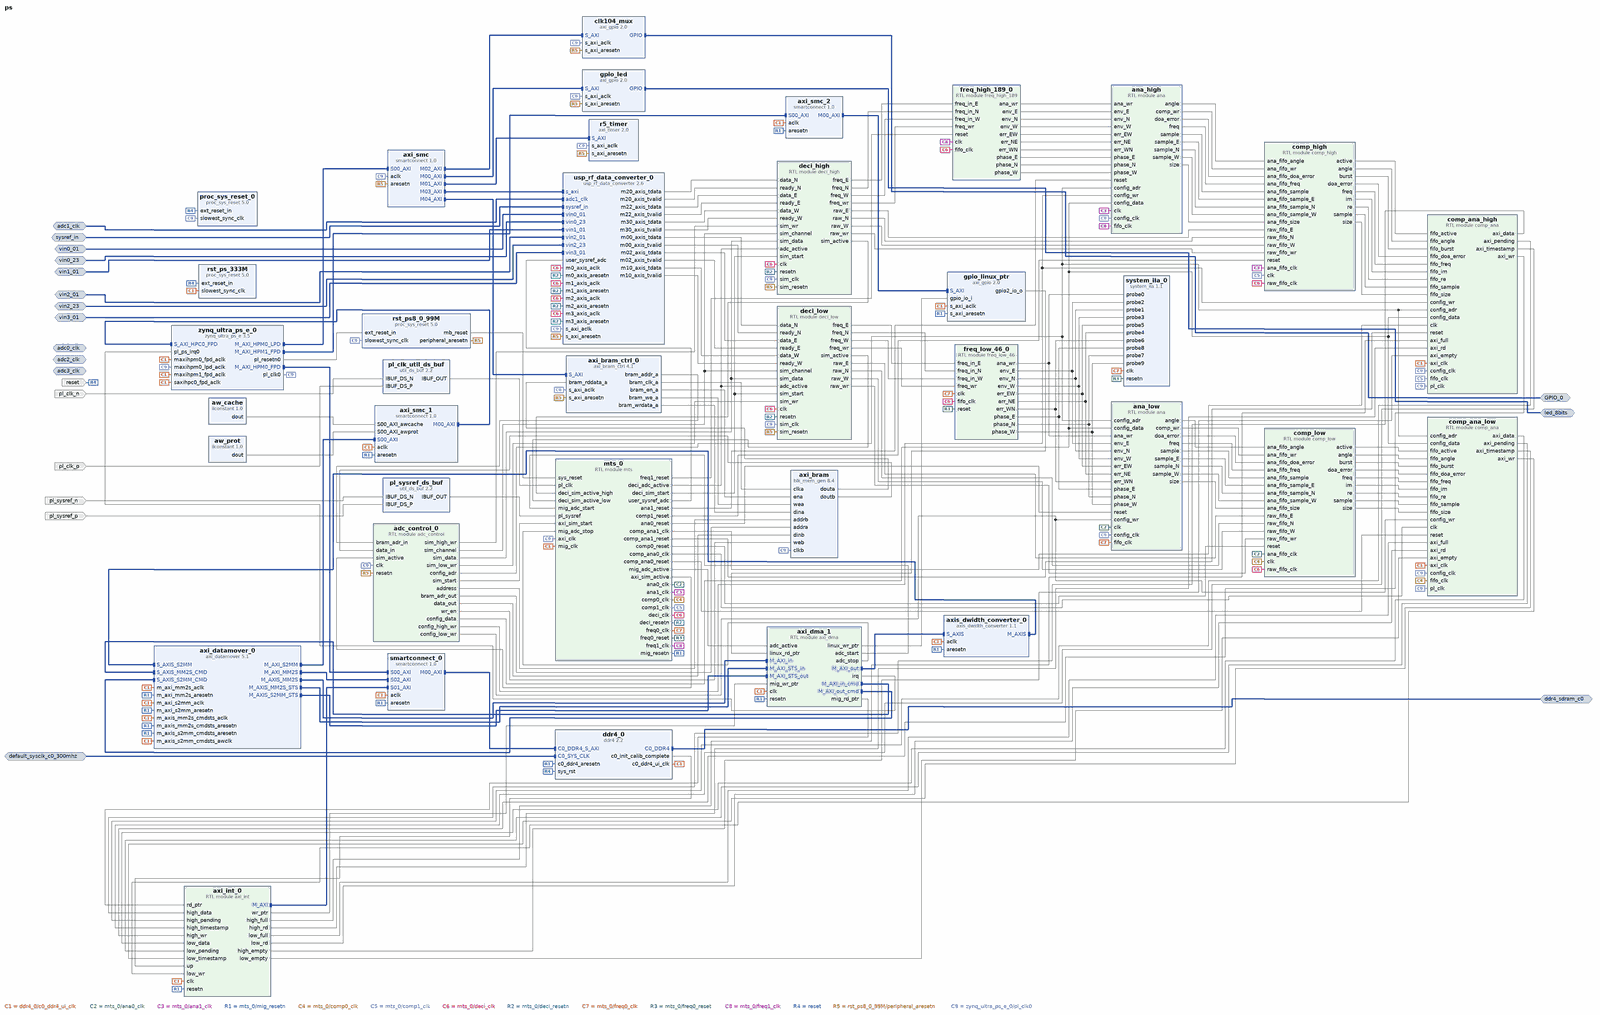
[diagram p0: block diagram of the top level, whole]
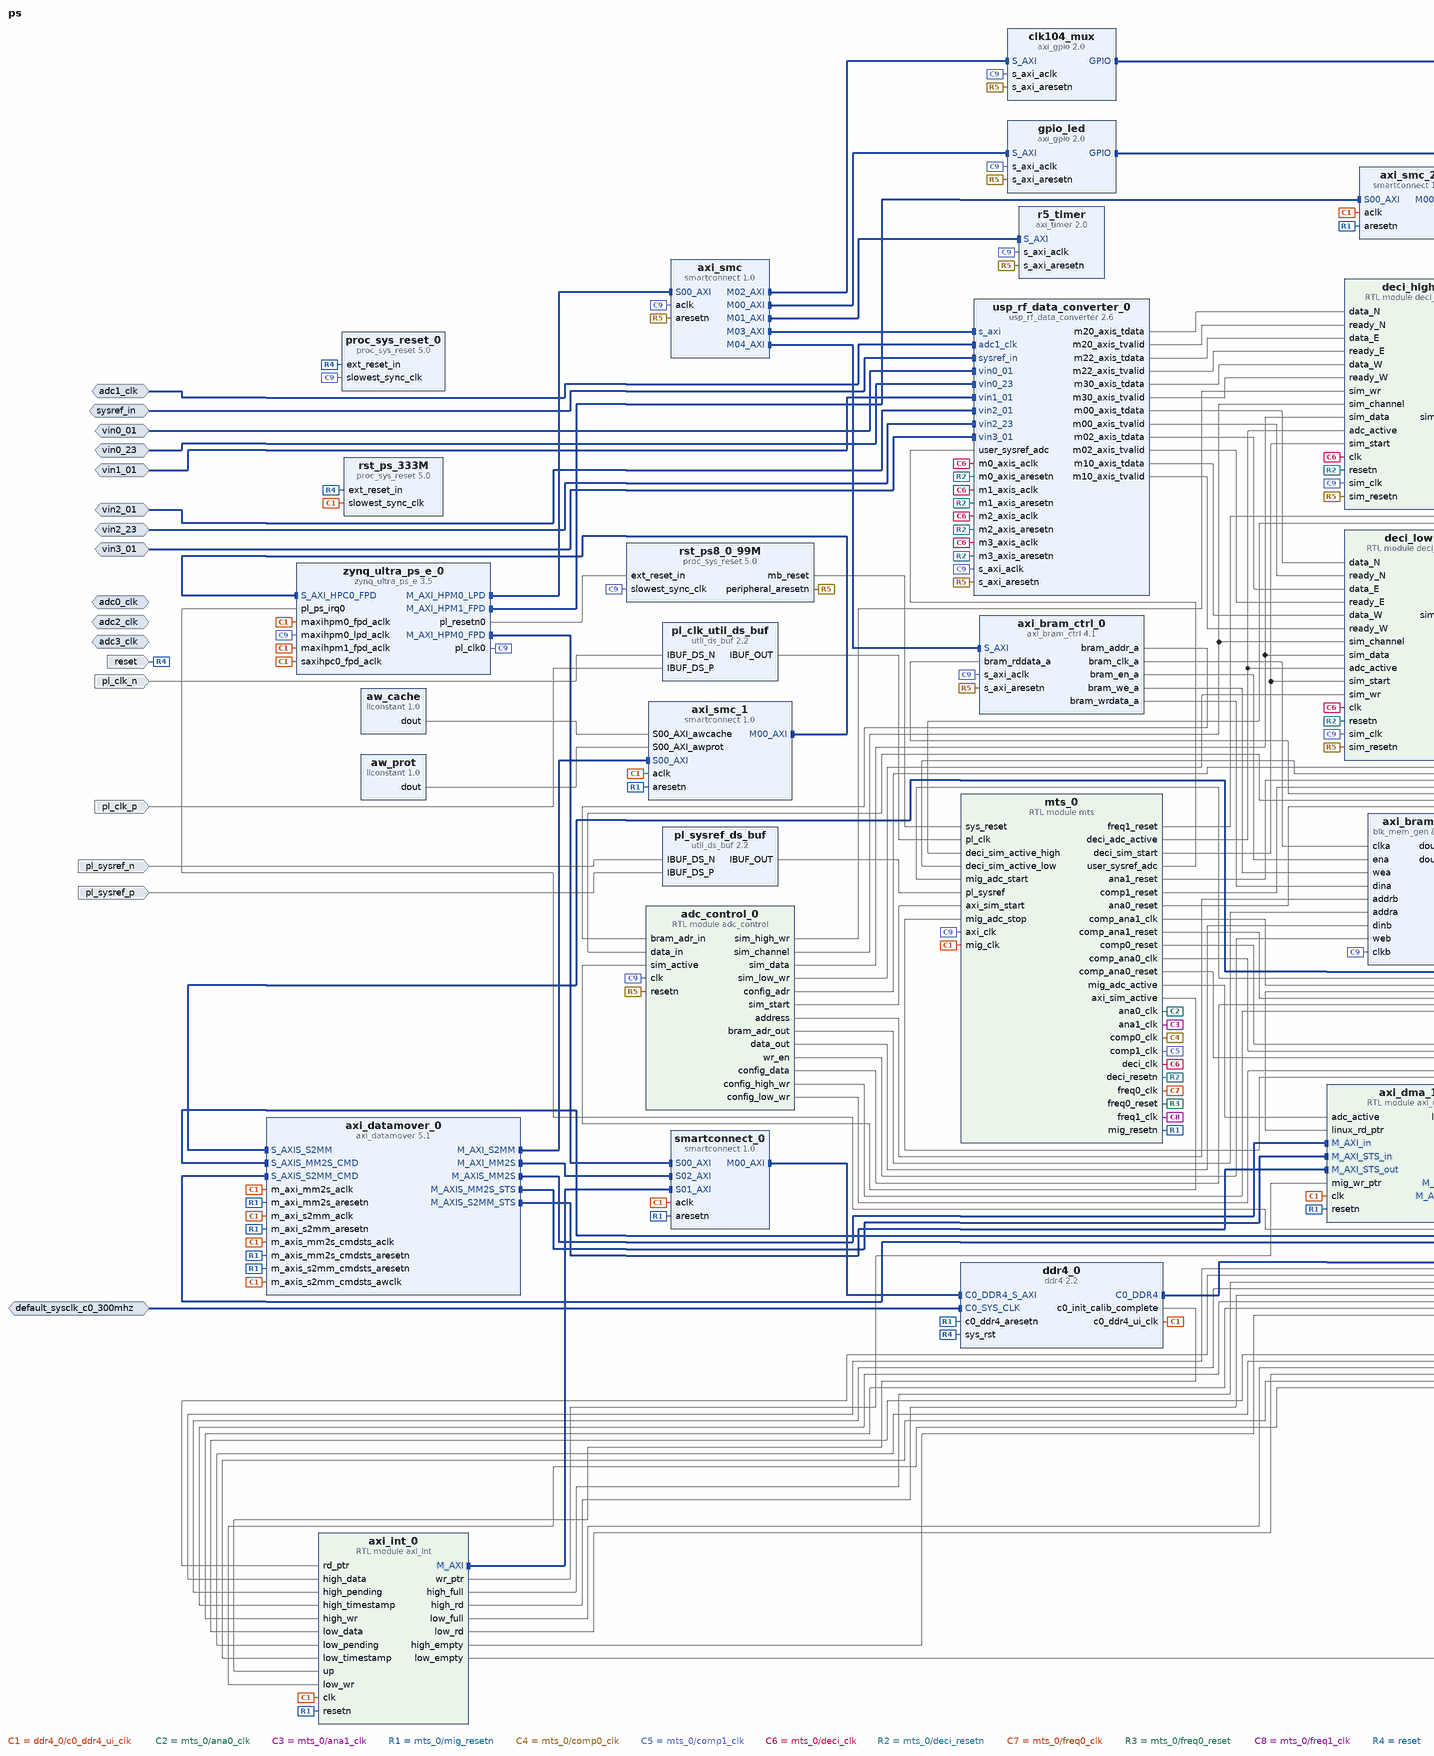
[diagram p1: block diagram of the top level, left part]
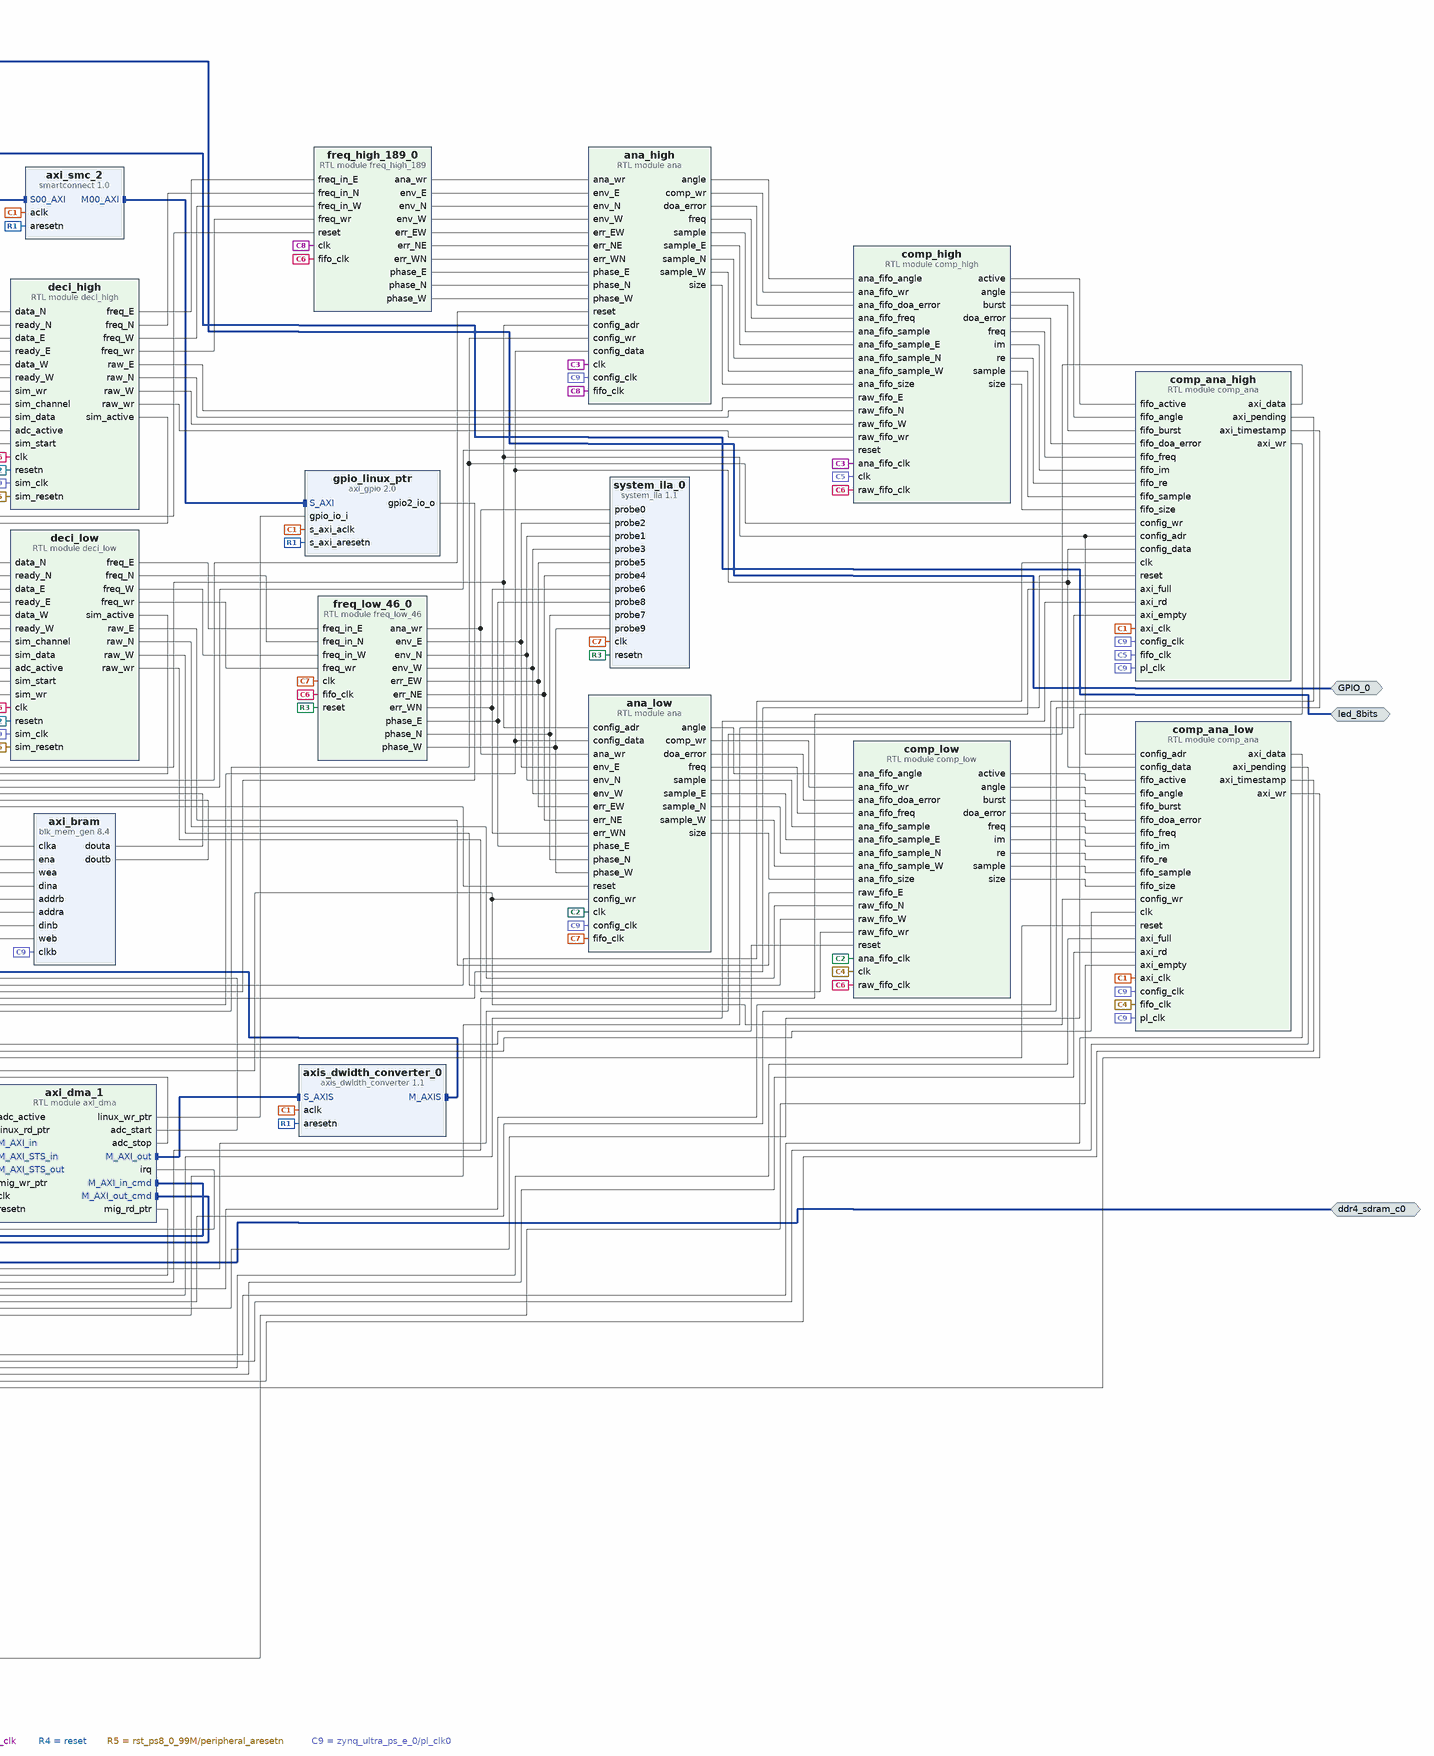
[diagram p2: block diagram of the top level, right part]
# Vivado block design ps, xczu48dr-fsvg1517-2-e, Vivado 2025.1
create_bd_design ps

create_bd_intf_port -mode Master -vlnv xilinx.com:interface:gpio_rtl:1.0 led_8bits
create_bd_intf_port -mode Master -vlnv xilinx.com:interface:gpio_rtl:1.0 GPIO_0
create_bd_intf_port -mode Slave -vlnv xilinx.com:interface:diff_analog_io_rtl:1.0 vin0_01
create_bd_intf_port -mode Slave -vlnv xilinx.com:interface:diff_analog_io_rtl:1.0 vin0_23
create_bd_intf_port -mode Slave -vlnv xilinx.com:interface:diff_analog_io_rtl:1.0 vin1_01
create_bd_intf_port -mode Slave -vlnv xilinx.com:interface:diff_analog_io_rtl:1.0 vin2_01
create_bd_intf_port -mode Slave -vlnv xilinx.com:interface:diff_analog_io_rtl:1.0 vin2_23
create_bd_intf_port -mode Slave -vlnv xilinx.com:interface:diff_analog_io_rtl:1.0 vin3_01
create_bd_intf_port -mode Slave -vlnv xilinx.com:display_usp_rf_data_converter:diff_pins_rtl:1.0 sysref_in
create_bd_intf_port -mode Slave -vlnv xilinx.com:interface:diff_clock_rtl:1.0 adc1_clk
set_property -dict {CONFIG.FREQ_HZ 500000000.0} [get_bd_intf_ports adc1_clk]
create_bd_intf_port -mode Slave -vlnv xilinx.com:interface:diff_clock_rtl:1.0 adc0_clk
set_property -dict {CONFIG.FREQ_HZ 4000000000.0} [get_bd_intf_ports adc0_clk]
create_bd_intf_port -mode Slave -vlnv xilinx.com:interface:diff_clock_rtl:1.0 adc2_clk
set_property -dict {CONFIG.FREQ_HZ 4000000000.0} [get_bd_intf_ports adc2_clk]
create_bd_intf_port -mode Slave -vlnv xilinx.com:interface:diff_clock_rtl:1.0 adc3_clk
set_property -dict {CONFIG.FREQ_HZ 4000000000.0} [get_bd_intf_ports adc3_clk]
create_bd_intf_port -mode Master -vlnv xilinx.com:interface:ddr4_rtl:1.0 ddr4_sdram_c0
create_bd_intf_port -mode Slave -vlnv xilinx.com:interface:diff_clock_rtl:1.0 default_sysclk_c0_300mhz
set_property -dict {CONFIG.FREQ_HZ 300000000} [get_bd_intf_ports default_sysclk_c0_300mhz]
create_bd_port -dir I -type clk pl_clk_p
set_property -dict {CONFIG.FREQ_HZ 125000000} [get_bd_ports pl_clk_p]
create_bd_port -dir I -type clk pl_clk_n
set_property -dict {CONFIG.FREQ_HZ 125000000} [get_bd_ports pl_clk_n]
create_bd_port -dir I -type clk pl_sysref_p
set_property -dict {CONFIG.FREQ_HZ 10000000} [get_bd_ports pl_sysref_p]
create_bd_port -dir I -type clk pl_sysref_n
set_property -dict {CONFIG.FREQ_HZ 10000000} [get_bd_ports pl_sysref_n]
create_bd_port -dir I -type rst reset
set_property -dict {CONFIG.POLARITY ACTIVE_HIGH} [get_bd_ports reset]

create_bd_cell -type ip -vlnv xilinx.com:ip:zynq_ultra_ps_e:3.5 zynq_ultra_ps_e_0
set_property -dict [list \
  CONFIG.PSU_BANK_0_IO_STANDARD LVCMOS18 \
  CONFIG.PSU_BANK_1_IO_STANDARD LVCMOS18 \
  CONFIG.PSU_BANK_2_IO_STANDARD LVCMOS18 \
  CONFIG.PSU_DYNAMIC_DDR_CONFIG_EN 1 \
  CONFIG.PSU_USB3__DUAL_CLOCK_ENABLE 1 \
  CONFIG.PSU__CAN1__PERIPHERAL__ENABLE 0 \
  CONFIG.PSU__CRF_APB__ACPU_CTRL__FREQMHZ 1200 \
  CONFIG.PSU__CRF_APB__ACPU_CTRL__SRCSEL APLL \
  CONFIG.PSU__CRF_APB__APLL_CTRL__SRCSEL PSS_REF_CLK \
  CONFIG.PSU__CRF_APB__DBG_FPD_CTRL__FREQMHZ 250 \
  CONFIG.PSU__CRF_APB__DBG_FPD_CTRL__SRCSEL IOPLL \
  CONFIG.PSU__CRF_APB__DBG_TRACE_CTRL__FREQMHZ 250 \
  CONFIG.PSU__CRF_APB__DBG_TRACE_CTRL__SRCSEL IOPLL \
  CONFIG.PSU__CRF_APB__DBG_TSTMP_CTRL__FREQMHZ 250 \
  CONFIG.PSU__CRF_APB__DBG_TSTMP_CTRL__SRCSEL IOPLL \
  CONFIG.PSU__CRF_APB__DDR_CTRL__FREQMHZ 1066 \
  CONFIG.PSU__CRF_APB__DDR_CTRL__SRCSEL DPLL \
  CONFIG.PSU__CRF_APB__DPDMA_REF_CTRL__FREQMHZ 600 \
  CONFIG.PSU__CRF_APB__DPDMA_REF_CTRL__SRCSEL APLL \
  CONFIG.PSU__CRF_APB__DPLL_CTRL__SRCSEL PSS_REF_CLK \
  CONFIG.PSU__CRF_APB__DP_AUDIO_REF_CTRL__SRCSEL RPLL \
  CONFIG.PSU__CRF_APB__DP_STC_REF_CTRL__SRCSEL RPLL \
  CONFIG.PSU__CRF_APB__DP_VIDEO_REF_CTRL__SRCSEL VPLL \
  CONFIG.PSU__CRF_APB__GDMA_REF_CTRL__FREQMHZ 600 \
  CONFIG.PSU__CRF_APB__GDMA_REF_CTRL__SRCSEL APLL \
  CONFIG.PSU__CRF_APB__GPU_REF_CTRL__FREQMHZ 500 \
  CONFIG.PSU__CRF_APB__GPU_REF_CTRL__SRCSEL IOPLL \
  CONFIG.PSU__CRF_APB__TOPSW_LSBUS_CTRL__FREQMHZ 100 \
  CONFIG.PSU__CRF_APB__TOPSW_LSBUS_CTRL__SRCSEL IOPLL \
  CONFIG.PSU__CRF_APB__TOPSW_MAIN_CTRL__FREQMHZ 533.33 \
  CONFIG.PSU__CRF_APB__TOPSW_MAIN_CTRL__SRCSEL DPLL \
  CONFIG.PSU__CRF_APB__VPLL_CTRL__SRCSEL PSS_REF_CLK \
  CONFIG.PSU__CRL_APB__ADMA_REF_CTRL__FREQMHZ 500 \
  CONFIG.PSU__CRL_APB__ADMA_REF_CTRL__SRCSEL IOPLL \
  CONFIG.PSU__CRL_APB__CAN1_REF_CTRL__FREQMHZ 100 \
  CONFIG.PSU__CRL_APB__CAN1_REF_CTRL__SRCSEL IOPLL \
  CONFIG.PSU__CRL_APB__CPU_R5_CTRL__FREQMHZ 500 \
  CONFIG.PSU__CRL_APB__CPU_R5_CTRL__SRCSEL IOPLL \
  CONFIG.PSU__CRL_APB__DBG_LPD_CTRL__FREQMHZ 250 \
  CONFIG.PSU__CRL_APB__DBG_LPD_CTRL__SRCSEL IOPLL \
  CONFIG.PSU__CRL_APB__GEM3_REF_CTRL__FREQMHZ 125 \
  CONFIG.PSU__CRL_APB__GEM3_REF_CTRL__SRCSEL IOPLL \
  CONFIG.PSU__CRL_APB__I2C0_REF_CTRL__FREQMHZ 100 \
  CONFIG.PSU__CRL_APB__I2C0_REF_CTRL__SRCSEL IOPLL \
  CONFIG.PSU__CRL_APB__I2C1_REF_CTRL__FREQMHZ 100 \
  CONFIG.PSU__CRL_APB__I2C1_REF_CTRL__SRCSEL IOPLL \
  CONFIG.PSU__CRL_APB__IOPLL_CTRL__SRCSEL PSS_REF_CLK \
  CONFIG.PSU__CRL_APB__IOU_SWITCH_CTRL__FREQMHZ 250 \
  CONFIG.PSU__CRL_APB__IOU_SWITCH_CTRL__SRCSEL IOPLL \
  CONFIG.PSU__CRL_APB__LPD_LSBUS_CTRL__FREQMHZ 100 \
  CONFIG.PSU__CRL_APB__LPD_LSBUS_CTRL__SRCSEL IOPLL \
  CONFIG.PSU__CRL_APB__LPD_SWITCH_CTRL__FREQMHZ 500 \
  CONFIG.PSU__CRL_APB__LPD_SWITCH_CTRL__SRCSEL IOPLL \
  CONFIG.PSU__CRL_APB__PCAP_CTRL__FREQMHZ 200 \
  CONFIG.PSU__CRL_APB__PCAP_CTRL__SRCSEL IOPLL \
  CONFIG.PSU__CRL_APB__PL0_REF_CTRL__FREQMHZ 100 \
  CONFIG.PSU__CRL_APB__PL0_REF_CTRL__SRCSEL IOPLL \
  CONFIG.PSU__CRL_APB__QSPI_REF_CTRL__FREQMHZ 125 \
  CONFIG.PSU__CRL_APB__QSPI_REF_CTRL__SRCSEL IOPLL \
  CONFIG.PSU__CRL_APB__RPLL_CTRL__SRCSEL PSS_REF_CLK \
  CONFIG.PSU__CRL_APB__SDIO1_REF_CTRL__FREQMHZ 200 \
  CONFIG.PSU__CRL_APB__SDIO1_REF_CTRL__SRCSEL IOPLL \
  CONFIG.PSU__CRL_APB__TIMESTAMP_REF_CTRL__FREQMHZ 100 \
  CONFIG.PSU__CRL_APB__TIMESTAMP_REF_CTRL__SRCSEL IOPLL \
  CONFIG.PSU__CRL_APB__UART0_REF_CTRL__FREQMHZ 100 \
  CONFIG.PSU__CRL_APB__UART0_REF_CTRL__SRCSEL IOPLL \
  CONFIG.PSU__CRL_APB__UART1_REF_CTRL__FREQMHZ 100 \
  CONFIG.PSU__CRL_APB__UART1_REF_CTRL__SRCSEL IOPLL \
  CONFIG.PSU__CRL_APB__USB0_BUS_REF_CTRL__FREQMHZ 250 \
  CONFIG.PSU__CRL_APB__USB0_BUS_REF_CTRL__SRCSEL IOPLL \
  CONFIG.PSU__CRL_APB__USB3_DUAL_REF_CTRL__FREQMHZ 20 \
  CONFIG.PSU__CRL_APB__USB3_DUAL_REF_CTRL__SRCSEL IOPLL \
  CONFIG.PSU__CRL_APB__USB3__ENABLE 1 \
  CONFIG.PSU__CSUPMU__PERIPHERAL__VALID 1 \
  CONFIG.PSU__DDRC__BUS_WIDTH {64 Bit} \
  CONFIG.PSU__DDRC__COMPONENTS UDIMM \
  CONFIG.PSU__DDRC__DEVICE_CAPACITY {8192 MBits} \
  CONFIG.PSU__DDRC__DRAM_WIDTH {16 Bits} \
  CONFIG.PSU__DDRC__ECC Disabled \
  CONFIG.PSU__DDRC__MEMORY_TYPE {DDR 4} \
  CONFIG.PSU__DDRC__SPEED_BIN DDR4_2133P \
  CONFIG.PSU__DDR_HIGH_ADDRESS_GUI_ENABLE 1 \
  CONFIG.PSU__DDR__INTERFACE__FREQMHZ 533.000 \
  CONFIG.PSU__DLL__ISUSED 1 \
  CONFIG.PSU__ENET3__FIFO__ENABLE 0 \
  CONFIG.PSU__ENET3__GRP_MDIO__ENABLE 1 \
  CONFIG.PSU__ENET3__GRP_MDIO__IO {MIO 76 .. 77} \
  CONFIG.PSU__ENET3__PERIPHERAL__ENABLE 1 \
  CONFIG.PSU__ENET3__PERIPHERAL__IO {MIO 64 .. 75} \
  CONFIG.PSU__ENET3__PTP__ENABLE 0 \
  CONFIG.PSU__ENET3__TSU__ENABLE 0 \
  CONFIG.PSU__FPGA_PL0_ENABLE 1 \
  CONFIG.PSU__GEM3_COHERENCY 0 \
  CONFIG.PSU__GEM3_ROUTE_THROUGH_FPD 0 \
  CONFIG.PSU__GEM__TSU__ENABLE 0 \
  CONFIG.PSU__GPIO0_MIO__IO {MIO 0 .. 25} \
  CONFIG.PSU__GPIO0_MIO__PERIPHERAL__ENABLE 1 \
  CONFIG.PSU__GPIO1_MIO__IO {MIO 26 .. 51} \
  CONFIG.PSU__GPIO1_MIO__PERIPHERAL__ENABLE 1 \
  CONFIG.PSU__I2C0__PERIPHERAL__ENABLE 1 \
  CONFIG.PSU__I2C0__PERIPHERAL__IO {MIO 14 .. 15} \
  CONFIG.PSU__I2C1__PERIPHERAL__ENABLE 1 \
  CONFIG.PSU__I2C1__PERIPHERAL__IO {MIO 16 .. 17} \
  CONFIG.PSU__IOU_SLCR__IOU_TTC_APB_CLK__TTC0_SEL APB \
  CONFIG.PSU__IOU_SLCR__IOU_TTC_APB_CLK__TTC1_SEL APB \
  CONFIG.PSU__IOU_SLCR__IOU_TTC_APB_CLK__TTC2_SEL APB \
  CONFIG.PSU__IOU_SLCR__IOU_TTC_APB_CLK__TTC3_SEL APB \
  CONFIG.PSU__MAXIGP0__DATA_WIDTH 128 \
  CONFIG.PSU__OVERRIDE__BASIC_CLOCK 0 \
  CONFIG.PSU__PMU_COHERENCY 0 \
  CONFIG.PSU__PMU__AIBACK__ENABLE 0 \
  CONFIG.PSU__PMU__EMIO_GPI__ENABLE 0 \
  CONFIG.PSU__PMU__EMIO_GPO__ENABLE 0 \
  CONFIG.PSU__PMU__GPI0__ENABLE 0 \
  CONFIG.PSU__PMU__GPI1__ENABLE 0 \
  CONFIG.PSU__PMU__GPI2__ENABLE 0 \
  CONFIG.PSU__PMU__GPI3__ENABLE 0 \
  CONFIG.PSU__PMU__GPI4__ENABLE 0 \
  CONFIG.PSU__PMU__GPI5__ENABLE 0 \
  CONFIG.PSU__PMU__GPO0__ENABLE 0 \
  CONFIG.PSU__PMU__GPO1__ENABLE 0 \
  CONFIG.PSU__PMU__GPO2__ENABLE 0 \
  CONFIG.PSU__PMU__GPO3__ENABLE 0 \
  CONFIG.PSU__PMU__GPO4__ENABLE 0 \
  CONFIG.PSU__PMU__GPO5__ENABLE 0 \
  CONFIG.PSU__PMU__PERIPHERAL__ENABLE 1 \
  CONFIG.PSU__PMU__PLERROR__ENABLE 0 \
  CONFIG.PSU__PRESET_APPLIED 1 \
  CONFIG.PSU__PSS_ALT_REF_CLK__ENABLE 1 \
  CONFIG.PSU__PSS_ALT_REF_CLK__IO {MIO 28} \
  CONFIG.PSU__PSS_REF_CLK__FREQMHZ 33.333 \
  CONFIG.PSU__QSPI_COHERENCY 0 \
  CONFIG.PSU__QSPI_ROUTE_THROUGH_FPD 0 \
  CONFIG.PSU__QSPI__GRP_FBCLK__ENABLE 1 \
  CONFIG.PSU__QSPI__GRP_FBCLK__IO {MIO 6} \
  CONFIG.PSU__QSPI__PERIPHERAL__DATA_MODE x4 \
  CONFIG.PSU__QSPI__PERIPHERAL__ENABLE 1 \
  CONFIG.PSU__QSPI__PERIPHERAL__IO {MIO 0 .. 12} \
  CONFIG.PSU__QSPI__PERIPHERAL__MODE {Dual Parallel} \
  CONFIG.PSU__SATA__LANE1__IO {GT Lane3} \
  CONFIG.PSU__SATA__PERIPHERAL__ENABLE 1 \
  CONFIG.PSU__SATA__REF_CLK_FREQ 125 \
  CONFIG.PSU__SATA__REF_CLK_SEL {Ref Clk3} \
  CONFIG.PSU__SD1_COHERENCY 0 \
  CONFIG.PSU__SD1_ROUTE_THROUGH_FPD 0 \
  CONFIG.PSU__SD1__CLK_100_SDR_OTAP_DLY 0x3 \
  CONFIG.PSU__SD1__CLK_200_SDR_OTAP_DLY 0x3 \
  CONFIG.PSU__SD1__CLK_50_DDR_ITAP_DLY 0x3D \
  CONFIG.PSU__SD1__CLK_50_DDR_OTAP_DLY 0x4 \
  CONFIG.PSU__SD1__CLK_50_SDR_ITAP_DLY 0x15 \
  CONFIG.PSU__SD1__CLK_50_SDR_OTAP_DLY 0x5 \
  CONFIG.PSU__SD1__DATA_TRANSFER_MODE 8Bit \
  CONFIG.PSU__SD1__GRP_CD__ENABLE 1 \
  CONFIG.PSU__SD1__GRP_CD__IO {MIO 45} \
  CONFIG.PSU__SD1__GRP_POW__ENABLE 0 \
  CONFIG.PSU__SD1__GRP_WP__ENABLE 0 \
  CONFIG.PSU__SD1__PERIPHERAL__ENABLE 1 \
  CONFIG.PSU__SD1__PERIPHERAL__IO {MIO 39 .. 51} \
  CONFIG.PSU__SD1__SLOT_TYPE {SD 3.0} \
  CONFIG.PSU__SWDT0__CLOCK__ENABLE 0 \
  CONFIG.PSU__SWDT0__PERIPHERAL__ENABLE 1 \
  CONFIG.PSU__SWDT0__RESET__ENABLE 0 \
  CONFIG.PSU__SWDT1__CLOCK__ENABLE 0 \
  CONFIG.PSU__SWDT1__PERIPHERAL__ENABLE 1 \
  CONFIG.PSU__SWDT1__RESET__ENABLE 0 \
  CONFIG.PSU__TSU__BUFG_PORT_PAIR 0 \
  CONFIG.PSU__TTC0__CLOCK__ENABLE 0 \
  CONFIG.PSU__TTC0__PERIPHERAL__ENABLE 1 \
  CONFIG.PSU__TTC0__WAVEOUT__ENABLE 0 \
  CONFIG.PSU__TTC1__CLOCK__ENABLE 0 \
  CONFIG.PSU__TTC1__PERIPHERAL__ENABLE 1 \
  CONFIG.PSU__TTC1__WAVEOUT__ENABLE 0 \
  CONFIG.PSU__TTC2__CLOCK__ENABLE 0 \
  CONFIG.PSU__TTC2__PERIPHERAL__ENABLE 1 \
  CONFIG.PSU__TTC2__WAVEOUT__ENABLE 0 \
  CONFIG.PSU__TTC3__CLOCK__ENABLE 0 \
  CONFIG.PSU__TTC3__PERIPHERAL__ENABLE 1 \
  CONFIG.PSU__TTC3__WAVEOUT__ENABLE 0 \
  CONFIG.PSU__UART0__BAUD_RATE 115200 \
  CONFIG.PSU__UART0__MODEM__ENABLE 0 \
  CONFIG.PSU__UART0__PERIPHERAL__ENABLE 1 \
  CONFIG.PSU__UART0__PERIPHERAL__IO {MIO 18 .. 19} \
  CONFIG.PSU__USB0_COHERENCY 0 \
  CONFIG.PSU__USB0__PERIPHERAL__ENABLE 1 \
  CONFIG.PSU__USB0__PERIPHERAL__IO {MIO 52 .. 63} \
  CONFIG.PSU__USB0__REF_CLK_FREQ 26 \
  CONFIG.PSU__USB0__REF_CLK_SEL {Ref Clk2} \
  CONFIG.PSU__USB2_0__EMIO__ENABLE 0 \
  CONFIG.PSU__USB3_0__EMIO__ENABLE 0 \
  CONFIG.PSU__USB3_0__PERIPHERAL__ENABLE 1 \
  CONFIG.PSU__USB3_0__PERIPHERAL__IO {GT Lane2} \
  CONFIG.PSU__USB__RESET__MODE {Boot Pin} \
  CONFIG.PSU__USB__RESET__POLARITY {Active Low} \
  CONFIG.PSU__USE__IRQ0 1 \
  CONFIG.PSU__USE__M_AXI_GP0 1 \
  CONFIG.PSU__USE__M_AXI_GP1 1 \
  CONFIG.PSU__USE__M_AXI_GP2 1 \
  CONFIG.PSU__USE__S_AXI_GP0 1 \
] [get_bd_cells zynq_ultra_ps_e_0]
# 111 more settings of zynq_ultra_ps_e_0 are not shown: defaults, MIO pin electricals, DDR timing, and values the tool derives
create_bd_cell -type ip -vlnv xilinx.com:ip:axi_timer:2.0 r5_timer
set_property -dict {CONFIG.enable_timer2 0} [get_bd_cells r5_timer]
create_bd_cell -type ip -vlnv xilinx.com:ip:axi_gpio:2.0 gpio_led
set_property -dict {CONFIG.GPIO_BOARD_INTERFACE led_8bits CONFIG.USE_BOARD_FLOW true} [get_bd_cells gpio_led]
create_bd_cell -type ip -vlnv xilinx.com:ip:smartconnect:1.0 axi_smc
set_property -dict {CONFIG.NUM_MI 5 CONFIG.NUM_SI 1} [get_bd_cells axi_smc]
create_bd_cell -type ip -vlnv xilinx.com:ip:proc_sys_reset:5.0 rst_ps8_0_99M
create_bd_cell -type ip -vlnv xilinx.com:ip:axi_gpio:2.0 clk104_mux
set_property -dict {CONFIG.C_ALL_OUTPUTS 1 CONFIG.C_GPIO_WIDTH 2} [get_bd_cells clk104_mux]
create_bd_cell -type ip -vlnv xilinx.com:ip:usp_rf_data_converter:2.6 usp_rf_data_converter_0
set_property -dict [list \
  CONFIG.ADC0_Clock_Dist 0 \
  CONFIG.ADC0_Clock_Source 1 \
  CONFIG.ADC0_Multi_Tile_Sync true \
  CONFIG.ADC0_Outclk_Freq 31.250 \
  CONFIG.ADC0_PLL_Enable false \
  CONFIG.ADC0_Refclk_Freq 4000.000 \
  CONFIG.ADC0_Sampling_Rate 4 \
  CONFIG.ADC1_Clock_Dist 1 \
  CONFIG.ADC1_Clock_Source 1 \
  CONFIG.ADC1_Multi_Tile_Sync true \
  CONFIG.ADC1_Outclk_Freq 31.250 \
  CONFIG.ADC1_PLL_Enable false \
  CONFIG.ADC1_Refclk_Freq 4000.000 \
  CONFIG.ADC1_Sampling_Rate 4 \
  CONFIG.ADC2_Clock_Dist 0 \
  CONFIG.ADC2_Clock_Source 1 \
  CONFIG.ADC2_Multi_Tile_Sync true \
  CONFIG.ADC2_Outclk_Freq 31.250 \
  CONFIG.ADC2_PLL_Enable false \
  CONFIG.ADC2_Refclk_Freq 4000.000 \
  CONFIG.ADC2_Sampling_Rate 4 \
  CONFIG.ADC3_Clock_Dist 0 \
  CONFIG.ADC3_Clock_Source 1 \
  CONFIG.ADC3_Multi_Tile_Sync true \
  CONFIG.ADC3_Outclk_Freq 31.250 \
  CONFIG.ADC3_PLL_Enable false \
  CONFIG.ADC3_Refclk_Freq 4000.000 \
  CONFIG.ADC3_Sampling_Rate 4 \
  CONFIG.ADC_Data_Width00 8 \
  CONFIG.ADC_Data_Width02 8 \
  CONFIG.ADC_Data_Width10 8 \
  CONFIG.ADC_Data_Width20 8 \
  CONFIG.ADC_Data_Width22 8 \
  CONFIG.ADC_Data_Width30 8 \
  CONFIG.ADC_Dither00 true \
  CONFIG.ADC_Slice02_Enable true \
  CONFIG.ADC_Slice10_Enable true \
  CONFIG.ADC_Slice20_Enable true \
  CONFIG.ADC_Slice22_Enable true \
  CONFIG.ADC_Slice30_Enable true \
  CONFIG.Axiclk_Freq 100 \
  CONFIG.RF_Analyzer 0 \
] [get_bd_cells usp_rf_data_converter_0]
create_bd_cell -type module -reference mts mts_0
create_bd_cell -type ip -vlnv xilinx.com:ip:util_ds_buf:2.2 pl_clk_util_ds_buf
create_bd_cell -type ip -vlnv xilinx.com:ip:util_ds_buf:2.2 pl_sysref_ds_buf
create_bd_cell -type module -reference deci_low deci_low
create_bd_cell -type module -reference deci_high deci_high
create_bd_cell -type module -reference adc_control adc_control_0
create_bd_cell -type ip -vlnv xilinx.com:ip:axi_bram_ctrl:4.1 axi_bram_ctrl_0
set_property -dict {CONFIG.SINGLE_PORT_BRAM 1} [get_bd_cells axi_bram_ctrl_0]
create_bd_cell -type ip -vlnv xilinx.com:ip:blk_mem_gen:8.4 axi_bram
set_property -dict [list \
  CONFIG.Assume_Synchronous_Clk true \
  CONFIG.Byte_Size 8 \
  CONFIG.Enable_B Always_Enabled \
  CONFIG.Memory_Type True_Dual_Port_RAM \
  CONFIG.Register_PortA_Output_of_Memory_Primitives false \
  CONFIG.Register_PortB_Output_of_Memory_Core false \
  CONFIG.Register_PortB_Output_of_Memory_Primitives false \
  CONFIG.Use_Byte_Write_Enable true \
  CONFIG.Use_RSTA_Pin true \
  CONFIG.Write_Depth_A 2048 \
  CONFIG.Write_Width_A 32 \
  CONFIG.use_bram_block Stand_Alone \
] [get_bd_cells axi_bram]
create_bd_cell -type module -reference freq_low_46 freq_low_46_0
create_bd_cell -type module -reference freq_high_189 freq_high_189_0
create_bd_cell -type module -reference ana ana_high
create_bd_cell -type module -reference ana ana_low
create_bd_cell -type module -reference comp_low comp_low
create_bd_cell -type module -reference comp_high comp_high
create_bd_cell -type module -reference comp_ana comp_ana_low
create_bd_cell -type module -reference comp_ana comp_ana_high
create_bd_cell -type ip -vlnv xilinx.com:ip:ddr4:2.2 ddr4_0
set_property -dict [list \
  CONFIG.C0_CLOCK_BOARD_INTERFACE default_sysclk_c0_300mhz \
  CONFIG.C0_DDR4_BOARD_INTERFACE ddr4_sdram_c0 \
  CONFIG.RESET_BOARD_INTERFACE reset \
] [get_bd_cells ddr4_0]
create_bd_cell -type ip -vlnv xilinx.com:ip:smartconnect:1.0 smartconnect_0
set_property -dict {CONFIG.NUM_CLKS 1 CONFIG.NUM_MI 1 CONFIG.NUM_SI 3} [get_bd_cells smartconnect_0]
create_bd_cell -type ip -vlnv xilinx.com:ip:proc_sys_reset:5.0 proc_sys_reset_0
set_property -dict {CONFIG.RESET_BOARD_INTERFACE reset CONFIG.USE_BOARD_FLOW true} [get_bd_cells proc_sys_reset_0]
create_bd_cell -type module -reference axi_int axi_int_0
create_bd_cell -type ip -vlnv xilinx.com:ip:axi_datamover:5.1 axi_datamover_0
set_property -dict [list \
  CONFIG.c_dummy 0 \
  CONFIG.c_enable_s2mm 1 \
  CONFIG.c_include_mm2s Full \
  CONFIG.c_m_axi_mm2s_id_width 0 \
  CONFIG.c_m_axi_s2mm_awid 0 \
  CONFIG.c_m_axi_s2mm_data_width 128 \
  CONFIG.c_m_axi_s2mm_id_width 0 \
  CONFIG.c_m_axis_mm2s_tdata_width 256 \
  CONFIG.c_mm2s_burst_size 128 \
  CONFIG.c_mm2s_include_sf false \
  CONFIG.c_s2mm_burst_size 32 \
  CONFIG.c_s_axis_s2mm_tdata_width 128 \
] [get_bd_cells axi_datamover_0]
create_bd_cell -type ip -vlnv xilinx.com:ip:smartconnect:1.0 axi_smc_1
set_property -dict {CONFIG.NUM_MI 1 CONFIG.NUM_SI 1} [get_bd_cells axi_smc_1]
create_bd_cell -type module -reference axi_dma axi_dma_1
create_bd_cell -type inline_hdl -vlnv xilinx.com:inline_hdl:ilconstant:1.0 aw_cache
set_property -dict {CONFIG.CONST_VAL 0xB CONFIG.CONST_WIDTH 4} [get_bd_cells aw_cache]
create_bd_cell -type inline_hdl -vlnv xilinx.com:inline_hdl:ilconstant:1.0 aw_prot
set_property -dict {CONFIG.CONST_VAL 2 CONFIG.CONST_WIDTH 3} [get_bd_cells aw_prot]
create_bd_cell -type ip -vlnv xilinx.com:ip:axi_gpio:2.0 gpio_linux_ptr
set_property -dict {CONFIG.C_ALL_INPUTS 1 CONFIG.C_ALL_OUTPUTS_2 1 CONFIG.C_IS_DUAL 1} [get_bd_cells gpio_linux_ptr]
create_bd_cell -type ip -vlnv xilinx.com:ip:smartconnect:1.0 axi_smc_2
set_property -dict {CONFIG.NUM_CLKS 1 CONFIG.NUM_SI 1} [get_bd_cells axi_smc_2]
create_bd_cell -type ip -vlnv xilinx.com:ip:axis_dwidth_converter:1.1 axis_dwidth_converter_0
set_property -dict [list \
  CONFIG.HAS_TKEEP 0 \
  CONFIG.HAS_TLAST 0 \
  CONFIG.M_TDATA_NUM_BYTES 16 \
  CONFIG.S_TDATA_NUM_BYTES 32 \
] [get_bd_cells axis_dwidth_converter_0]
create_bd_cell -type ip -vlnv xilinx.com:ip:proc_sys_reset:5.0 rst_ps_333M
set_property -dict {CONFIG.RESET_BOARD_INTERFACE reset CONFIG.USE_BOARD_FLOW true} [get_bd_cells rst_ps_333M]
create_bd_cell -type ip -vlnv xilinx.com:ip:system_ila:1.1 system_ila_0
set_property -dict [list \
  CONFIG.C_MON_TYPE MIX \
  CONFIG.C_NUM_MONITOR_SLOTS 1 \
  CONFIG.C_NUM_OF_PROBES 10 \
  CONFIG.C_PROBE0_TYPE 0 \
  CONFIG.C_PROBE1_TYPE 1 \
  CONFIG.C_PROBE2_TYPE 1 \
  CONFIG.C_PROBE3_TYPE 1 \
  CONFIG.C_PROBE4_TYPE 1 \
  CONFIG.C_PROBE5_TYPE 1 \
  CONFIG.C_PROBE6_TYPE 1 \
  CONFIG.C_PROBE7_TYPE 1 \
  CONFIG.C_PROBE8_TYPE 1 \
  CONFIG.C_PROBE9_TYPE 1 \
] [get_bd_cells system_ila_0]

# ---- connections ----

connect_bd_intf_net [get_bd_intf_ports adc1_clk] [get_bd_intf_pins usp_rf_data_converter_0/adc1_clk]
connect_bd_intf_net [get_bd_intf_pins axi_datamover_0/M_AXIS_MM2S] [get_bd_intf_pins axi_dma_1/M_AXI_in]
connect_bd_intf_net [get_bd_intf_pins axi_dma_1/M_AXI_STS_in] [get_bd_intf_pins axi_datamover_0/M_AXIS_MM2S_STS]
connect_bd_intf_net [get_bd_intf_pins axi_dma_1/M_AXI_STS_out] [get_bd_intf_pins axi_datamover_0/M_AXIS_S2MM_STS]
connect_bd_intf_net [get_bd_intf_pins axi_datamover_0/M_AXI_MM2S] [get_bd_intf_pins smartconnect_0/S02_AXI]
connect_bd_intf_net [get_bd_intf_pins axi_smc_1/S00_AXI] [get_bd_intf_pins axi_datamover_0/M_AXI_S2MM]
connect_bd_intf_net -intf_net axi_dma_1_M_AXI_cmd [get_bd_intf_pins axi_datamover_0/S_AXIS_MM2S_CMD] [get_bd_intf_pins axi_dma_1/M_AXI_in_cmd]
connect_bd_intf_net [get_bd_intf_pins axi_dma_1/M_AXI_out] [get_bd_intf_pins axis_dwidth_converter_0/S_AXIS]
connect_bd_intf_net [get_bd_intf_pins axi_datamover_0/S_AXIS_S2MM_CMD] [get_bd_intf_pins axi_dma_1/M_AXI_out_cmd]
connect_bd_intf_net -intf_net axi_gpio_0_GPIO [get_bd_intf_ports led_8bits] [get_bd_intf_pins gpio_led/GPIO]
connect_bd_intf_net [get_bd_intf_pins axi_int_0/M_AXI] [get_bd_intf_pins smartconnect_0/S01_AXI]
connect_bd_intf_net [get_bd_intf_pins axi_smc_1/M00_AXI] [get_bd_intf_pins zynq_ultra_ps_e_0/S_AXI_HPC0_FPD]
connect_bd_intf_net [get_bd_intf_pins axi_smc_2/M00_AXI] [get_bd_intf_pins gpio_linux_ptr/S_AXI]
connect_bd_intf_net [get_bd_intf_pins axi_smc/M00_AXI] [get_bd_intf_pins gpio_led/S_AXI]
connect_bd_intf_net [get_bd_intf_pins axi_smc/M01_AXI] [get_bd_intf_pins r5_timer/S_AXI]
connect_bd_intf_net [get_bd_intf_pins axi_smc/M02_AXI] [get_bd_intf_pins clk104_mux/S_AXI]
connect_bd_intf_net [get_bd_intf_pins axi_smc/M03_AXI] [get_bd_intf_pins usp_rf_data_converter_0/s_axi]
connect_bd_intf_net [get_bd_intf_pins axi_smc/M04_AXI] [get_bd_intf_pins axi_bram_ctrl_0/S_AXI]
connect_bd_intf_net [get_bd_intf_pins axis_dwidth_converter_0/M_AXIS] [get_bd_intf_pins axi_datamover_0/S_AXIS_S2MM]
connect_bd_intf_net [get_bd_intf_ports GPIO_0] [get_bd_intf_pins clk104_mux/GPIO]
connect_bd_intf_net [get_bd_intf_ports ddr4_sdram_c0] [get_bd_intf_pins ddr4_0/C0_DDR4]
connect_bd_intf_net [get_bd_intf_ports default_sysclk_c0_300mhz] [get_bd_intf_pins ddr4_0/C0_SYS_CLK]
connect_bd_intf_net [get_bd_intf_pins smartconnect_0/M00_AXI] [get_bd_intf_pins ddr4_0/C0_DDR4_S_AXI]
connect_bd_intf_net [get_bd_intf_ports sysref_in] [get_bd_intf_pins usp_rf_data_converter_0/sysref_in]
connect_bd_intf_net -intf_net vin0_01_1 [get_bd_intf_ports vin0_01] [get_bd_intf_pins usp_rf_data_converter_0/vin0_01]
connect_bd_intf_net -intf_net vin0_23_1 [get_bd_intf_ports vin0_23] [get_bd_intf_pins usp_rf_data_converter_0/vin0_23]
connect_bd_intf_net -intf_net vin1_01_1 [get_bd_intf_ports vin1_01] [get_bd_intf_pins usp_rf_data_converter_0/vin1_01]
connect_bd_intf_net -intf_net vin2_01_1 [get_bd_intf_ports vin2_01] [get_bd_intf_pins usp_rf_data_converter_0/vin2_01]
connect_bd_intf_net -intf_net vin2_23_1 [get_bd_intf_ports vin2_23] [get_bd_intf_pins usp_rf_data_converter_0/vin2_23]
connect_bd_intf_net -intf_net vin3_01_1 [get_bd_intf_ports vin3_01] [get_bd_intf_pins usp_rf_data_converter_0/vin3_01]
connect_bd_intf_net [get_bd_intf_pins smartconnect_0/S00_AXI] [get_bd_intf_pins zynq_ultra_ps_e_0/M_AXI_HPM0_FPD]
connect_bd_intf_net [get_bd_intf_pins zynq_ultra_ps_e_0/M_AXI_HPM0_LPD] [get_bd_intf_pins axi_smc/S00_AXI]
connect_bd_intf_net [get_bd_intf_pins zynq_ultra_ps_e_0/M_AXI_HPM1_FPD] [get_bd_intf_pins axi_smc_2/S00_AXI]
connect_bd_net [get_bd_pins adc_control_0/address] [get_bd_pins axi_bram/addrb]
connect_bd_net [get_bd_pins adc_control_0/bram_adr_out] [get_bd_pins axi_bram/addra]
connect_bd_net [get_bd_pins adc_control_0/config_adr] \
  [get_bd_pins comp_ana_low/config_adr] [get_bd_pins comp_ana_high/config_adr] [get_bd_pins ana_low/config_adr] \
  [get_bd_pins ana_high/config_adr]
connect_bd_net [get_bd_pins adc_control_0/config_data] \
  [get_bd_pins comp_ana_low/config_data] [get_bd_pins comp_ana_high/config_data] [get_bd_pins ana_low/config_data] \
  [get_bd_pins ana_high/config_data]
connect_bd_net [get_bd_pins adc_control_0/config_high_wr] [get_bd_pins comp_ana_high/config_wr] [get_bd_pins ana_high/config_wr]
connect_bd_net [get_bd_pins adc_control_0/config_low_wr] [get_bd_pins comp_ana_low/config_wr] [get_bd_pins ana_low/config_wr]
connect_bd_net [get_bd_pins adc_control_0/data_out] [get_bd_pins axi_bram/dinb]
connect_bd_net -net adc_control_0_sim_active [get_bd_pins mts_0/axi_sim_active] [get_bd_pins adc_control_0/sim_active]
connect_bd_net [get_bd_pins adc_control_0/sim_channel] [get_bd_pins deci_high/sim_channel] [get_bd_pins deci_low/sim_channel]
connect_bd_net [get_bd_pins adc_control_0/sim_data] [get_bd_pins deci_high/sim_data] [get_bd_pins deci_low/sim_data]
connect_bd_net [get_bd_pins adc_control_0/sim_high_wr] [get_bd_pins deci_high/sim_wr]
connect_bd_net [get_bd_pins adc_control_0/sim_low_wr] [get_bd_pins deci_low/sim_wr]
connect_bd_net [get_bd_pins adc_control_0/sim_start] [get_bd_pins mts_0/axi_sim_start]
connect_bd_net [get_bd_pins adc_control_0/wr_en] [get_bd_pins axi_bram/web]
connect_bd_net [get_bd_pins ana_high/angle] [get_bd_pins comp_high/ana_fifo_angle]
connect_bd_net [get_bd_pins ana_high/comp_wr] [get_bd_pins comp_high/ana_fifo_wr]
connect_bd_net [get_bd_pins ana_high/doa_error] [get_bd_pins comp_high/ana_fifo_doa_error]
connect_bd_net [get_bd_pins ana_high/freq] [get_bd_pins comp_high/ana_fifo_freq]
connect_bd_net [get_bd_pins ana_high/sample] [get_bd_pins comp_high/ana_fifo_sample]
connect_bd_net [get_bd_pins ana_high/sample_E] [get_bd_pins comp_high/ana_fifo_sample_E]
connect_bd_net [get_bd_pins ana_high/sample_N] [get_bd_pins comp_high/ana_fifo_sample_N]
connect_bd_net [get_bd_pins ana_high/sample_W] [get_bd_pins comp_high/ana_fifo_sample_W]
connect_bd_net [get_bd_pins ana_high/size] [get_bd_pins comp_high/ana_fifo_size]
connect_bd_net [get_bd_pins ana_low/angle] [get_bd_pins comp_low/ana_fifo_angle]
connect_bd_net [get_bd_pins ana_low/comp_wr] [get_bd_pins comp_low/ana_fifo_wr]
connect_bd_net [get_bd_pins ana_low/doa_error] [get_bd_pins comp_low/ana_fifo_doa_error]
connect_bd_net [get_bd_pins ana_low/freq] [get_bd_pins comp_low/ana_fifo_freq]
connect_bd_net [get_bd_pins ana_low/sample] [get_bd_pins comp_low/ana_fifo_sample]
connect_bd_net [get_bd_pins ana_low/sample_E] [get_bd_pins comp_low/ana_fifo_sample_E]
connect_bd_net [get_bd_pins ana_low/sample_N] [get_bd_pins comp_low/ana_fifo_sample_N]
connect_bd_net [get_bd_pins ana_low/sample_W] [get_bd_pins comp_low/ana_fifo_sample_W]
connect_bd_net [get_bd_pins ana_low/size] [get_bd_pins comp_low/ana_fifo_size]
connect_bd_net [get_bd_pins axi_bram_ctrl_0/bram_addr_a] [get_bd_pins adc_control_0/bram_adr_in]
connect_bd_net [get_bd_pins axi_bram_ctrl_0/bram_clk_a] [get_bd_pins axi_bram/clka]
connect_bd_net [get_bd_pins axi_bram_ctrl_0/bram_en_a] [get_bd_pins axi_bram/ena]
connect_bd_net [get_bd_pins axi_bram_ctrl_0/bram_we_a] [get_bd_pins axi_bram/wea]
connect_bd_net [get_bd_pins axi_bram_ctrl_0/bram_wrdata_a] [get_bd_pins axi_bram/dina]
connect_bd_net [get_bd_pins axi_bram/douta] [get_bd_pins axi_bram_ctrl_0/bram_rddata_a]
connect_bd_net [get_bd_pins axi_bram/doutb] [get_bd_pins adc_control_0/data_in]
connect_bd_net [get_bd_pins axi_dma_1/adc_start] [get_bd_pins mts_0/mig_adc_start]
connect_bd_net [get_bd_pins axi_dma_1/adc_stop] [get_bd_pins mts_0/mig_adc_stop]
connect_bd_net [get_bd_pins axi_dma_1/irq] [get_bd_pins zynq_ultra_ps_e_0/pl_ps_irq0]
connect_bd_net [get_bd_pins axi_dma_1/linux_wr_ptr] [get_bd_pins gpio_linux_ptr/gpio_io_i]
connect_bd_net -net axi_dma_1_rd_ptr [get_bd_pins axi_dma_1/mig_rd_ptr] [get_bd_pins axi_int_0/rd_ptr]
connect_bd_net [get_bd_pins axi_int_0/high_full] [get_bd_pins comp_ana_high/axi_full]
connect_bd_net [get_bd_pins axi_int_0/high_rd] [get_bd_pins comp_ana_high/axi_rd]
connect_bd_net [get_bd_pins axi_int_0/low_full] [get_bd_pins comp_ana_low/axi_full]
connect_bd_net [get_bd_pins axi_int_0/low_rd] [get_bd_pins comp_ana_low/axi_rd]
connect_bd_net [get_bd_pins axi_int_0/wr_ptr] [get_bd_pins axi_dma_1/mig_wr_ptr]
connect_bd_net [get_bd_pins comp_ana_high/axi_data] [get_bd_pins axi_int_0/high_data]
connect_bd_net -net comp_ana_high_axi_empty [get_bd_pins axi_int_0/high_empty] [get_bd_pins comp_ana_high/axi_empty]
connect_bd_net [get_bd_pins comp_ana_high/axi_pending] [get_bd_pins axi_int_0/high_pending]
connect_bd_net [get_bd_pins comp_ana_high/axi_timestamp] [get_bd_pins axi_int_0/high_timestamp]
connect_bd_net [get_bd_pins comp_ana_high/axi_wr] [get_bd_pins axi_int_0/high_wr]
connect_bd_net [get_bd_pins comp_ana_low/axi_data] [get_bd_pins axi_int_0/low_data]
connect_bd_net -net comp_ana_low_axi_empty [get_bd_pins axi_int_0/low_empty] [get_bd_pins comp_ana_low/axi_empty]
connect_bd_net [get_bd_pins comp_ana_low/axi_pending] [get_bd_pins axi_int_0/low_pending]
connect_bd_net [get_bd_pins comp_ana_low/axi_timestamp] [get_bd_pins axi_int_0/low_timestamp]
connect_bd_net [get_bd_pins comp_ana_low/axi_wr] [get_bd_pins axi_int_0/low_wr]
connect_bd_net [get_bd_pins comp_high/active] [get_bd_pins comp_ana_high/fifo_active]
connect_bd_net [get_bd_pins comp_high/angle] [get_bd_pins comp_ana_high/fifo_angle]
connect_bd_net [get_bd_pins comp_high/burst] [get_bd_pins comp_ana_high/fifo_burst]
connect_bd_net [get_bd_pins comp_high/doa_error] [get_bd_pins comp_ana_high/fifo_doa_error]
connect_bd_net [get_bd_pins comp_high/freq] [get_bd_pins comp_ana_high/fifo_freq]
connect_bd_net [get_bd_pins comp_high/im] [get_bd_pins comp_ana_high/fifo_im]
connect_bd_net [get_bd_pins comp_high/re] [get_bd_pins comp_ana_high/fifo_re]
connect_bd_net [get_bd_pins comp_high/sample] [get_bd_pins comp_ana_high/fifo_sample]
connect_bd_net [get_bd_pins comp_high/size] [get_bd_pins comp_ana_high/fifo_size]
connect_bd_net [get_bd_pins comp_low/active] [get_bd_pins comp_ana_low/fifo_active]
connect_bd_net [get_bd_pins comp_low/angle] [get_bd_pins comp_ana_low/fifo_angle]
connect_bd_net [get_bd_pins comp_low/burst] [get_bd_pins comp_ana_low/fifo_burst]
connect_bd_net [get_bd_pins comp_low/doa_error] [get_bd_pins comp_ana_low/fifo_doa_error]
connect_bd_net [get_bd_pins comp_low/freq] [get_bd_pins comp_ana_low/fifo_freq]
connect_bd_net [get_bd_pins comp_low/im] [get_bd_pins comp_ana_low/fifo_im]
connect_bd_net [get_bd_pins comp_low/re] [get_bd_pins comp_ana_low/fifo_re]
connect_bd_net [get_bd_pins comp_low/sample] [get_bd_pins comp_ana_low/fifo_sample]
connect_bd_net [get_bd_pins comp_low/size] [get_bd_pins comp_ana_low/fifo_size]
connect_bd_net [get_bd_pins ddr4_0/c0_ddr4_ui_clk] \
  [get_bd_pins axi_smc_2/aclk] [get_bd_pins axi_datamover_0/m_axi_mm2s_aclk] \
  [get_bd_pins axi_datamover_0/m_axis_mm2s_cmdsts_aclk] [get_bd_pins axi_smc_1/aclk] [get_bd_pins smartconnect_0/aclk] \
  [get_bd_pins zynq_ultra_ps_e_0/maxihpm0_fpd_aclk] [get_bd_pins zynq_ultra_ps_e_0/maxihpm1_fpd_aclk] \
  [get_bd_pins zynq_ultra_ps_e_0/saxihpc0_fpd_aclk] [get_bd_pins gpio_linux_ptr/s_axi_aclk] [get_bd_pins axi_int_0/clk] \
  [get_bd_pins axis_dwidth_converter_0/aclk] [get_bd_pins rst_ps_333M/slowest_sync_clk] \
  [get_bd_pins axi_datamover_0/m_axi_s2mm_aclk] [get_bd_pins axi_datamover_0/m_axis_s2mm_cmdsts_awclk] \
  [get_bd_pins comp_ana_low/axi_clk] [get_bd_pins comp_ana_high/axi_clk] [get_bd_pins axi_dma_1/clk] \
  [get_bd_pins mts_0/mig_clk]
connect_bd_net [get_bd_pins ddr4_0/c0_init_calib_complete] [get_bd_pins axi_int_0/up]
connect_bd_net [get_bd_pins deci_high/freq_E] [get_bd_pins freq_high_189_0/freq_in_E]
connect_bd_net [get_bd_pins deci_high/freq_N] [get_bd_pins freq_high_189_0/freq_in_N]
connect_bd_net [get_bd_pins deci_high/freq_W] [get_bd_pins freq_high_189_0/freq_in_W]
connect_bd_net [get_bd_pins deci_high/freq_wr] [get_bd_pins freq_high_189_0/freq_wr]
connect_bd_net [get_bd_pins deci_high/raw_E] [get_bd_pins comp_high/raw_fifo_E]
connect_bd_net [get_bd_pins deci_high/raw_N] [get_bd_pins comp_high/raw_fifo_N]
connect_bd_net [get_bd_pins deci_high/raw_W] [get_bd_pins comp_high/raw_fifo_W]
connect_bd_net [get_bd_pins deci_high/raw_wr] [get_bd_pins comp_high/raw_fifo_wr]
connect_bd_net [get_bd_pins deci_low/freq_E] [get_bd_pins freq_low_46_0/freq_in_E]
connect_bd_net [get_bd_pins deci_low/freq_N] [get_bd_pins freq_low_46_0/freq_in_N]
connect_bd_net [get_bd_pins deci_low/freq_W] [get_bd_pins freq_low_46_0/freq_in_W]
connect_bd_net [get_bd_pins deci_low/freq_wr] [get_bd_pins freq_low_46_0/freq_wr]
connect_bd_net [get_bd_pins deci_low/raw_E] [get_bd_pins comp_low/raw_fifo_E]
connect_bd_net [get_bd_pins deci_low/raw_N] [get_bd_pins comp_low/raw_fifo_N]
connect_bd_net [get_bd_pins deci_low/raw_W] [get_bd_pins comp_low/raw_fifo_W]
connect_bd_net [get_bd_pins deci_low/raw_wr] [get_bd_pins comp_low/raw_fifo_wr]
connect_bd_net [get_bd_pins deci_low/sim_active] [get_bd_pins mts_0/deci_sim_active_low]
connect_bd_net [get_bd_pins freq_high_189_0/ana_wr] [get_bd_pins ana_high/ana_wr]
connect_bd_net [get_bd_pins freq_high_189_0/env_E] [get_bd_pins ana_high/env_E]
connect_bd_net [get_bd_pins freq_high_189_0/env_N] [get_bd_pins ana_high/env_N]
connect_bd_net [get_bd_pins freq_high_189_0/env_W] [get_bd_pins ana_high/env_W]
connect_bd_net [get_bd_pins freq_high_189_0/err_EW] [get_bd_pins ana_high/err_EW]
connect_bd_net [get_bd_pins freq_high_189_0/err_NE] [get_bd_pins ana_high/err_NE]
connect_bd_net [get_bd_pins freq_high_189_0/err_WN] [get_bd_pins ana_high/err_WN]
connect_bd_net [get_bd_pins freq_high_189_0/phase_E] [get_bd_pins ana_high/phase_E]
connect_bd_net [get_bd_pins freq_high_189_0/phase_N] [get_bd_pins ana_high/phase_N]
connect_bd_net [get_bd_pins freq_high_189_0/phase_W] [get_bd_pins ana_high/phase_W]
connect_bd_net -net freq_low_46_0_ana_wr [get_bd_pins freq_low_46_0/ana_wr] [get_bd_pins system_ila_0/probe0] [get_bd_pins ana_low/ana_wr]
connect_bd_net -net freq_low_46_0_env_E [get_bd_pins freq_low_46_0/env_E] [get_bd_pins system_ila_0/probe2] [get_bd_pins ana_low/env_E]
connect_bd_net -net freq_low_46_0_env_N [get_bd_pins freq_low_46_0/env_N] [get_bd_pins system_ila_0/probe1] [get_bd_pins ana_low/env_N]
connect_bd_net -net freq_low_46_0_env_W [get_bd_pins freq_low_46_0/env_W] [get_bd_pins system_ila_0/probe3] [get_bd_pins ana_low/env_W]
connect_bd_net -net freq_low_46_0_err_EW [get_bd_pins freq_low_46_0/err_EW] [get_bd_pins system_ila_0/probe5] [get_bd_pins ana_low/err_EW]
connect_bd_net -net freq_low_46_0_err_NE [get_bd_pins freq_low_46_0/err_NE] [get_bd_pins system_ila_0/probe4] [get_bd_pins ana_low/err_NE]
connect_bd_net -net freq_low_46_0_err_WN [get_bd_pins freq_low_46_0/err_WN] [get_bd_pins system_ila_0/probe6] [get_bd_pins ana_low/err_WN]
connect_bd_net -net freq_low_46_0_phase_E [get_bd_pins freq_low_46_0/phase_E] [get_bd_pins system_ila_0/probe8] [get_bd_pins ana_low/phase_E]
connect_bd_net -net freq_low_46_0_phase_N [get_bd_pins freq_low_46_0/phase_N] [get_bd_pins system_ila_0/probe7] [get_bd_pins ana_low/phase_N]
connect_bd_net -net freq_low_46_0_phase_W [get_bd_pins freq_low_46_0/phase_W] [get_bd_pins system_ila_0/probe9] [get_bd_pins ana_low/phase_W]
connect_bd_net [get_bd_pins gpio_linux_ptr/gpio2_io_o] [get_bd_pins axi_dma_1/linux_rd_ptr]
connect_bd_net -net ilconstant_0_dout [get_bd_pins aw_cache/dout] [get_bd_pins axi_smc_1/S00_AXI_awcache]
connect_bd_net -net ilconstant_0_dout1 [get_bd_pins aw_prot/dout] [get_bd_pins axi_smc_1/S00_AXI_awprot]
connect_bd_net [get_bd_pins mts_0/ana0_clk] [get_bd_pins comp_low/ana_fifo_clk] [get_bd_pins ana_low/clk]
connect_bd_net [get_bd_pins mts_0/ana0_reset] [get_bd_pins ana_low/reset]
connect_bd_net [get_bd_pins mts_0/ana1_clk] [get_bd_pins comp_high/ana_fifo_clk] [get_bd_pins ana_high/clk]
connect_bd_net [get_bd_pins mts_0/ana1_reset] [get_bd_pins ana_high/reset]
connect_bd_net -net mts_0_axi_reset_out [get_bd_pins mts_0/mig_resetn] \
  [get_bd_pins axi_datamover_0/m_axi_mm2s_aresetn] [get_bd_pins axi_datamover_0/m_axis_mm2s_cmdsts_aresetn] \
  [get_bd_pins axi_smc_1/aresetn] [get_bd_pins ddr4_0/c0_ddr4_aresetn] [get_bd_pins smartconnect_0/aresetn] \
  [get_bd_pins gpio_linux_ptr/s_axi_aresetn] [get_bd_pins axi_smc_2/aresetn] [get_bd_pins axi_int_0/resetn] \
  [get_bd_pins axis_dwidth_converter_0/aresetn] [get_bd_pins axi_datamover_0/m_axi_s2mm_aresetn] \
  [get_bd_pins axi_datamover_0/m_axis_s2mm_cmdsts_aresetn] [get_bd_pins axi_dma_1/resetn]
connect_bd_net [get_bd_pins mts_0/comp0_clk] [get_bd_pins comp_ana_low/fifo_clk] [get_bd_pins comp_low/clk]
connect_bd_net [get_bd_pins mts_0/comp0_reset] [get_bd_pins comp_low/reset]
connect_bd_net [get_bd_pins mts_0/comp1_clk] [get_bd_pins comp_high/clk] [get_bd_pins comp_ana_high/fifo_clk]
connect_bd_net [get_bd_pins mts_0/comp1_reset] [get_bd_pins comp_high/reset]
connect_bd_net [get_bd_pins mts_0/comp_ana0_clk] [get_bd_pins comp_ana_low/clk]
connect_bd_net [get_bd_pins mts_0/comp_ana0_reset] [get_bd_pins comp_ana_low/reset]
connect_bd_net [get_bd_pins mts_0/comp_ana1_clk] [get_bd_pins comp_ana_high/clk]
connect_bd_net [get_bd_pins mts_0/comp_ana1_reset] [get_bd_pins comp_ana_high/reset]
connect_bd_net [get_bd_pins mts_0/deci_adc_active] [get_bd_pins deci_high/adc_active] [get_bd_pins deci_low/adc_active]
connect_bd_net [get_bd_pins mts_0/deci_clk] \
  [get_bd_pins usp_rf_data_converter_0/m0_axis_aclk] [get_bd_pins usp_rf_data_converter_0/m1_axis_aclk] \
  [get_bd_pins usp_rf_data_converter_0/m2_axis_aclk] [get_bd_pins usp_rf_data_converter_0/m3_axis_aclk] \
  [get_bd_pins freq_low_46_0/fifo_clk] [get_bd_pins freq_high_189_0/fifo_clk] [get_bd_pins deci_high/clk] \
  [get_bd_pins deci_low/clk] [get_bd_pins comp_high/raw_fifo_clk] [get_bd_pins comp_low/raw_fifo_clk]
connect_bd_net [get_bd_pins mts_0/deci_resetn] \
  [get_bd_pins usp_rf_data_converter_0/m0_axis_aresetn] [get_bd_pins usp_rf_data_converter_0/m1_axis_aresetn] \
  [get_bd_pins usp_rf_data_converter_0/m2_axis_aresetn] [get_bd_pins usp_rf_data_converter_0/m3_axis_aresetn] \
  [get_bd_pins deci_high/resetn] [get_bd_pins deci_low/resetn]
connect_bd_net -net mts_0_deci_sim_active [get_bd_pins deci_high/sim_active] [get_bd_pins mts_0/deci_sim_active_high]
connect_bd_net [get_bd_pins mts_0/deci_sim_start] [get_bd_pins deci_high/sim_start] [get_bd_pins deci_low/sim_start]
connect_bd_net [get_bd_pins mts_0/freq0_clk] [get_bd_pins freq_low_46_0/clk] [get_bd_pins system_ila_0/clk] [get_bd_pins ana_low/fifo_clk]
connect_bd_net [get_bd_pins mts_0/freq0_reset] [get_bd_pins freq_low_46_0/reset] [get_bd_pins system_ila_0/resetn]
connect_bd_net [get_bd_pins mts_0/freq1_clk] [get_bd_pins freq_high_189_0/clk] [get_bd_pins ana_high/fifo_clk]
connect_bd_net [get_bd_pins mts_0/freq1_reset] [get_bd_pins freq_high_189_0/reset]
connect_bd_net [get_bd_pins mts_0/mig_adc_active] [get_bd_pins axi_dma_1/adc_active]
connect_bd_net [get_bd_pins mts_0/user_sysref_adc] [get_bd_pins usp_rf_data_converter_0/user_sysref_adc]
connect_bd_net [get_bd_ports pl_clk_n] [get_bd_pins pl_clk_util_ds_buf/IBUF_DS_N]
connect_bd_net [get_bd_ports pl_clk_p] [get_bd_pins pl_clk_util_ds_buf/IBUF_DS_P]
connect_bd_net [get_bd_ports pl_sysref_n] [get_bd_pins pl_sysref_ds_buf/IBUF_DS_N]
connect_bd_net [get_bd_ports pl_sysref_p] [get_bd_pins pl_sysref_ds_buf/IBUF_DS_P]
connect_bd_net [get_bd_ports reset] [get_bd_pins ddr4_0/sys_rst] [get_bd_pins proc_sys_reset_0/ext_reset_in] [get_bd_pins rst_ps_333M/ext_reset_in]
connect_bd_net [get_bd_pins rst_ps8_0_99M/mb_reset] [get_bd_pins mts_0/sys_reset]
connect_bd_net [get_bd_pins rst_ps8_0_99M/peripheral_aresetn] \
  [get_bd_pins gpio_led/s_axi_aresetn] [get_bd_pins axi_smc/aresetn] [get_bd_pins r5_timer/s_axi_aresetn] \
  [get_bd_pins clk104_mux/s_axi_aresetn] [get_bd_pins usp_rf_data_converter_0/s_axi_aresetn] \
  [get_bd_pins axi_bram_ctrl_0/s_axi_aresetn] [get_bd_pins deci_high/sim_resetn] [get_bd_pins deci_low/sim_resetn] \
  [get_bd_pins adc_control_0/resetn]
connect_bd_net [get_bd_pins usp_rf_data_converter_0/m00_axis_tdata] [get_bd_pins deci_low/data_N]
connect_bd_net [get_bd_pins usp_rf_data_converter_0/m00_axis_tvalid] [get_bd_pins deci_low/ready_N]
connect_bd_net [get_bd_pins usp_rf_data_converter_0/m02_axis_tdata] [get_bd_pins deci_low/data_E]
connect_bd_net [get_bd_pins usp_rf_data_converter_0/m02_axis_tvalid] [get_bd_pins deci_low/ready_E]
connect_bd_net [get_bd_pins usp_rf_data_converter_0/m10_axis_tdata] [get_bd_pins deci_low/data_W]
connect_bd_net [get_bd_pins usp_rf_data_converter_0/m10_axis_tvalid] [get_bd_pins deci_low/ready_W]
connect_bd_net [get_bd_pins usp_rf_data_converter_0/m20_axis_tdata] [get_bd_pins deci_high/data_N]
connect_bd_net [get_bd_pins usp_rf_data_converter_0/m20_axis_tvalid] [get_bd_pins deci_high/ready_N]
connect_bd_net [get_bd_pins usp_rf_data_converter_0/m22_axis_tdata] [get_bd_pins deci_high/data_E]
connect_bd_net [get_bd_pins usp_rf_data_converter_0/m22_axis_tvalid] [get_bd_pins deci_high/ready_E]
connect_bd_net [get_bd_pins usp_rf_data_converter_0/m30_axis_tdata] [get_bd_pins deci_high/data_W]
connect_bd_net [get_bd_pins usp_rf_data_converter_0/m30_axis_tvalid] [get_bd_pins deci_high/ready_W]
connect_bd_net -net util_ds_buf_0_IBUF_OUT [get_bd_pins pl_clk_util_ds_buf/IBUF_OUT] [get_bd_pins mts_0/pl_clk]
connect_bd_net -net util_ds_buf_0_IBUF_OUT1 [get_bd_pins pl_sysref_ds_buf/IBUF_OUT] [get_bd_pins mts_0/pl_sysref]
connect_bd_net [get_bd_pins zynq_ultra_ps_e_0/pl_clk0] \
  [get_bd_pins axi_smc/aclk] [get_bd_pins gpio_led/s_axi_aclk] [get_bd_pins rst_ps8_0_99M/slowest_sync_clk] \
  [get_bd_pins r5_timer/s_axi_aclk] [get_bd_pins zynq_ultra_ps_e_0/maxihpm0_lpd_aclk] [get_bd_pins clk104_mux/s_axi_aclk] \
  [get_bd_pins usp_rf_data_converter_0/s_axi_aclk] [get_bd_pins axi_bram_ctrl_0/s_axi_aclk] [get_bd_pins axi_bram/clkb] \
  [get_bd_pins deci_high/sim_clk] [get_bd_pins deci_low/sim_clk] [get_bd_pins proc_sys_reset_0/slowest_sync_clk] \
  [get_bd_pins comp_ana_low/config_clk] [get_bd_pins comp_ana_low/pl_clk] [get_bd_pins comp_ana_high/config_clk] \
  [get_bd_pins comp_ana_high/pl_clk] [get_bd_pins adc_control_0/clk] [get_bd_pins mts_0/axi_clk] \
  [get_bd_pins ana_low/config_clk] [get_bd_pins ana_high/config_clk]
connect_bd_net [get_bd_pins zynq_ultra_ps_e_0/pl_resetn0] [get_bd_pins rst_ps8_0_99M/ext_reset_in]
set_property HDL_ATTRIBUTE.DEBUG true [get_bd_nets freq_low_46_0_ana_wr]
set_property HDL_ATTRIBUTE.MARK_DEBUG true [get_bd_nets freq_low_46_0_ana_wr]
set_property HDL_ATTRIBUTE.DEBUG true [get_bd_nets freq_low_46_0_env_E]
set_property HDL_ATTRIBUTE.MARK_DEBUG true [get_bd_nets freq_low_46_0_env_E]
set_property HDL_ATTRIBUTE.DEBUG true [get_bd_nets freq_low_46_0_env_N]
set_property HDL_ATTRIBUTE.MARK_DEBUG true [get_bd_nets freq_low_46_0_env_N]
set_property HDL_ATTRIBUTE.DEBUG true [get_bd_nets freq_low_46_0_env_W]
set_property HDL_ATTRIBUTE.MARK_DEBUG true [get_bd_nets freq_low_46_0_env_W]
set_property HDL_ATTRIBUTE.DEBUG true [get_bd_nets freq_low_46_0_err_EW]
set_property HDL_ATTRIBUTE.MARK_DEBUG true [get_bd_nets freq_low_46_0_err_EW]
set_property HDL_ATTRIBUTE.DEBUG true [get_bd_nets freq_low_46_0_err_NE]
set_property HDL_ATTRIBUTE.MARK_DEBUG true [get_bd_nets freq_low_46_0_err_NE]
set_property HDL_ATTRIBUTE.DEBUG true [get_bd_nets freq_low_46_0_err_WN]
set_property HDL_ATTRIBUTE.MARK_DEBUG true [get_bd_nets freq_low_46_0_err_WN]
set_property HDL_ATTRIBUTE.DEBUG true [get_bd_nets freq_low_46_0_phase_E]
set_property HDL_ATTRIBUTE.MARK_DEBUG true [get_bd_nets freq_low_46_0_phase_E]
set_property HDL_ATTRIBUTE.DEBUG true [get_bd_nets freq_low_46_0_phase_N]
set_property HDL_ATTRIBUTE.MARK_DEBUG true [get_bd_nets freq_low_46_0_phase_N]
set_property HDL_ATTRIBUTE.DEBUG true [get_bd_nets freq_low_46_0_phase_W]
set_property HDL_ATTRIBUTE.MARK_DEBUG true [get_bd_nets freq_low_46_0_phase_W]

# ---- address map ----
assign_bd_address -offset 0x00000000 -range 4G -target_address_space [get_bd_addr_spaces axi_datamover_0/Data_MM2S] [get_bd_addr_segs ddr4_0/C0_DDR4_MEMORY_MAP/C0_DDR4_ADDRESS_BLOCK]
exclude_bd_addr_seg -offset 0x00000000 -range 1 -target_address_space [get_bd_addr_spaces axi_datamover_0/Data_MM2S] [get_bd_addr_segs gpio_linux_ptr/S_AXI/Reg]
exclude_bd_addr_seg -offset 0x00000000 -range 1 -target_address_space [get_bd_addr_spaces axi_datamover_0/Data_MM2S] [get_bd_addr_segs zynq_ultra_ps_e_0/SAXIGP0/HPC0_DDR_HIGH]
exclude_bd_addr_seg -offset 0x00000000 -range 1 -target_address_space [get_bd_addr_spaces axi_datamover_0/Data_MM2S] [get_bd_addr_segs zynq_ultra_ps_e_0/SAXIGP0/HPC0_DDR_LOW]
exclude_bd_addr_seg -offset 0x00000000 -range 1 -target_address_space [get_bd_addr_spaces axi_datamover_0/Data_MM2S] [get_bd_addr_segs zynq_ultra_ps_e_0/SAXIGP0/HPC0_LPS_OCM]
exclude_bd_addr_seg -offset 0x00000000 -range 1 -target_address_space [get_bd_addr_spaces axi_datamover_0/Data_MM2S] [get_bd_addr_segs zynq_ultra_ps_e_0/SAXIGP0/HPC0_QSPI]
assign_bd_address -offset 0x00000000 -range 2G -target_address_space [get_bd_addr_spaces axi_datamover_0/Data_S2MM] [get_bd_addr_segs zynq_ultra_ps_e_0/SAXIGP0/HPC0_DDR_LOW]
assign_bd_address -offset 0x00000000 -range 4G -target_address_space [get_bd_addr_spaces axi_int_0/M_AXI] [get_bd_addr_segs ddr4_0/C0_DDR4_MEMORY_MAP/C0_DDR4_ADDRESS_BLOCK]
exclude_bd_addr_seg -offset 0x00000000 -range 1 -target_address_space [get_bd_addr_spaces axi_int_0/M_AXI] [get_bd_addr_segs gpio_linux_ptr/S_AXI/Reg]
exclude_bd_addr_seg -offset 0x00000000 -range 1 -target_address_space [get_bd_addr_spaces axi_int_0/M_AXI] [get_bd_addr_segs zynq_ultra_ps_e_0/SAXIGP0/HPC0_DDR_HIGH]
exclude_bd_addr_seg -offset 0x00000000 -range 1 -target_address_space [get_bd_addr_spaces axi_int_0/M_AXI] [get_bd_addr_segs zynq_ultra_ps_e_0/SAXIGP0/HPC0_DDR_LOW]
exclude_bd_addr_seg -offset 0x00000000 -range 1 -target_address_space [get_bd_addr_spaces axi_int_0/M_AXI] [get_bd_addr_segs zynq_ultra_ps_e_0/SAXIGP0/HPC0_LPS_OCM]
exclude_bd_addr_seg -offset 0x00000000 -range 1 -target_address_space [get_bd_addr_spaces axi_int_0/M_AXI] [get_bd_addr_segs zynq_ultra_ps_e_0/SAXIGP0/HPC0_QSPI]
assign_bd_address -offset 0x0080000000 -range 8K -target_address_space [get_bd_addr_spaces zynq_ultra_ps_e_0/Data] [get_bd_addr_segs axi_bram_ctrl_0/S_AXI/Mem0]
assign_bd_address -offset 0x0080040000 -range 64K -target_address_space [get_bd_addr_spaces zynq_ultra_ps_e_0/Data] [get_bd_addr_segs clk104_mux/S_AXI/Reg]
assign_bd_address -offset 0x0080050000 -range 64K -target_address_space [get_bd_addr_spaces zynq_ultra_ps_e_0/Data] [get_bd_addr_segs gpio_led/S_AXI/Reg]
assign_bd_address -offset 0x0080060000 -range 64K -target_address_space [get_bd_addr_spaces zynq_ultra_ps_e_0/Data] [get_bd_addr_segs r5_timer/S_AXI/Reg]
assign_bd_address -offset 0x0080080000 -range 256K -target_address_space [get_bd_addr_spaces zynq_ultra_ps_e_0/Data] [get_bd_addr_segs usp_rf_data_converter_0/s_axi/Reg]
assign_bd_address -offset 0x00B0000000 -range 4K -target_address_space [get_bd_addr_spaces zynq_ultra_ps_e_0/Data] [get_bd_addr_segs gpio_linux_ptr/S_AXI/Reg]
assign_bd_address -offset 0x0400000000 -range 4G -target_address_space [get_bd_addr_spaces zynq_ultra_ps_e_0/Data] [get_bd_addr_segs ddr4_0/C0_DDR4_MEMORY_MAP/C0_DDR4_ADDRESS_BLOCK]
exclude_bd_addr_seg -offset 0x0080000000 -range 1 -target_address_space [get_bd_addr_spaces zynq_ultra_ps_e_0/Data] [get_bd_addr_segs zynq_ultra_ps_e_0/SAXIGP0/HPC0_DDR_HIGH]
exclude_bd_addr_seg -offset 0x0080000000 -range 1 -target_address_space [get_bd_addr_spaces zynq_ultra_ps_e_0/Data] [get_bd_addr_segs zynq_ultra_ps_e_0/SAXIGP0/HPC0_DDR_LOW]
exclude_bd_addr_seg -offset 0x0080000000 -range 1 -target_address_space [get_bd_addr_spaces zynq_ultra_ps_e_0/Data] [get_bd_addr_segs zynq_ultra_ps_e_0/SAXIGP0/HPC0_LPS_OCM]
exclude_bd_addr_seg -offset 0x0080000000 -range 1 -target_address_space [get_bd_addr_spaces zynq_ultra_ps_e_0/Data] [get_bd_addr_segs zynq_ultra_ps_e_0/SAXIGP0/HPC0_QSPI]

validate_bd_design
save_bd_design
